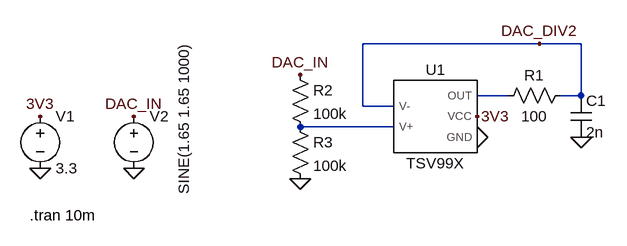
[diagram p0: schematic DAC div2 TSV99x.asc]
DAC div2 TSV99x.asc, the LTspice schematic file:
Version 4
SHEET 1 880 680
WIRE 368 32 96 32
WIRE 432 32 368 32
WIRE 320 112 272 112
WIRE 432 112 432 32
WIRE 432 112 400 112
WIRE 96 128 96 32
WIRE 144 128 96 128
WIRE 144 160 0 160
FLAG 0 240 0
FLAG 0 80 DAC_IN
FLAG -400 144 3V3
FLAG -400 224 0
FLAG -256 224 0
FLAG 272 176 0
FLAG -256 144 DAC_IN
FLAG 272 144 3V3
FLAG 432 176 0
FLAG 368 32 DAC_DIV2
SYMBOL AutoGenerated\\TSV99X 208 144 R0
SYMATTR InstName U1
SYMBOL res 304 128 R270
WINDOW 0 32 56 VTop 2
WINDOW 3 0 56 VBottom 2
SYMATTR InstName R1
SYMATTR Value 100
SYMBOL res -16 64 R0
SYMATTR InstName R2
SYMATTR Value 100k
SYMBOL res -16 144 R0
SYMATTR InstName R3
SYMATTR Value 100k
SYMBOL voltage -400 128 R0
SYMATTR InstName V1
SYMATTR Value 3.3
SYMBOL voltage -256 128 R0
WINDOW 3 77 136 VLeft 2
WINDOW 123 0 0 Left 2
WINDOW 39 0 0 Left 2
SYMATTR InstName V2
SYMATTR Value SINE(1.65 1.65 1000)
SYMBOL cap 416 112 R0
SYMATTR InstName C1
SYMATTR Value 2n
TEXT -416 296 Left 2 !.tran 10m

The netlist it stands for:
* DAC div2 TSV99x.asc
XU1 DAC_DIV2 N002 N001 3V3 0 TSV99X  ; pins V- V+ OUT VCC GND
R1 N001 DAC_DIV2 100
R2 DAC_IN N002 100k
R3 N002 0 100k
V1 3V3 0 3.3
V2 DAC_IN 0 SINE(1.65 1.65 1000)
C1 DAC_DIV2 0 2n
.tran 10m
.lib D:\Github\LTSpice\LTS0000 - Models\TSX631.mod
.backanno
.end